# Altium schematic sheet Power System.SchDoc
size A; SheetNumber: 2; SheetTotal: 3
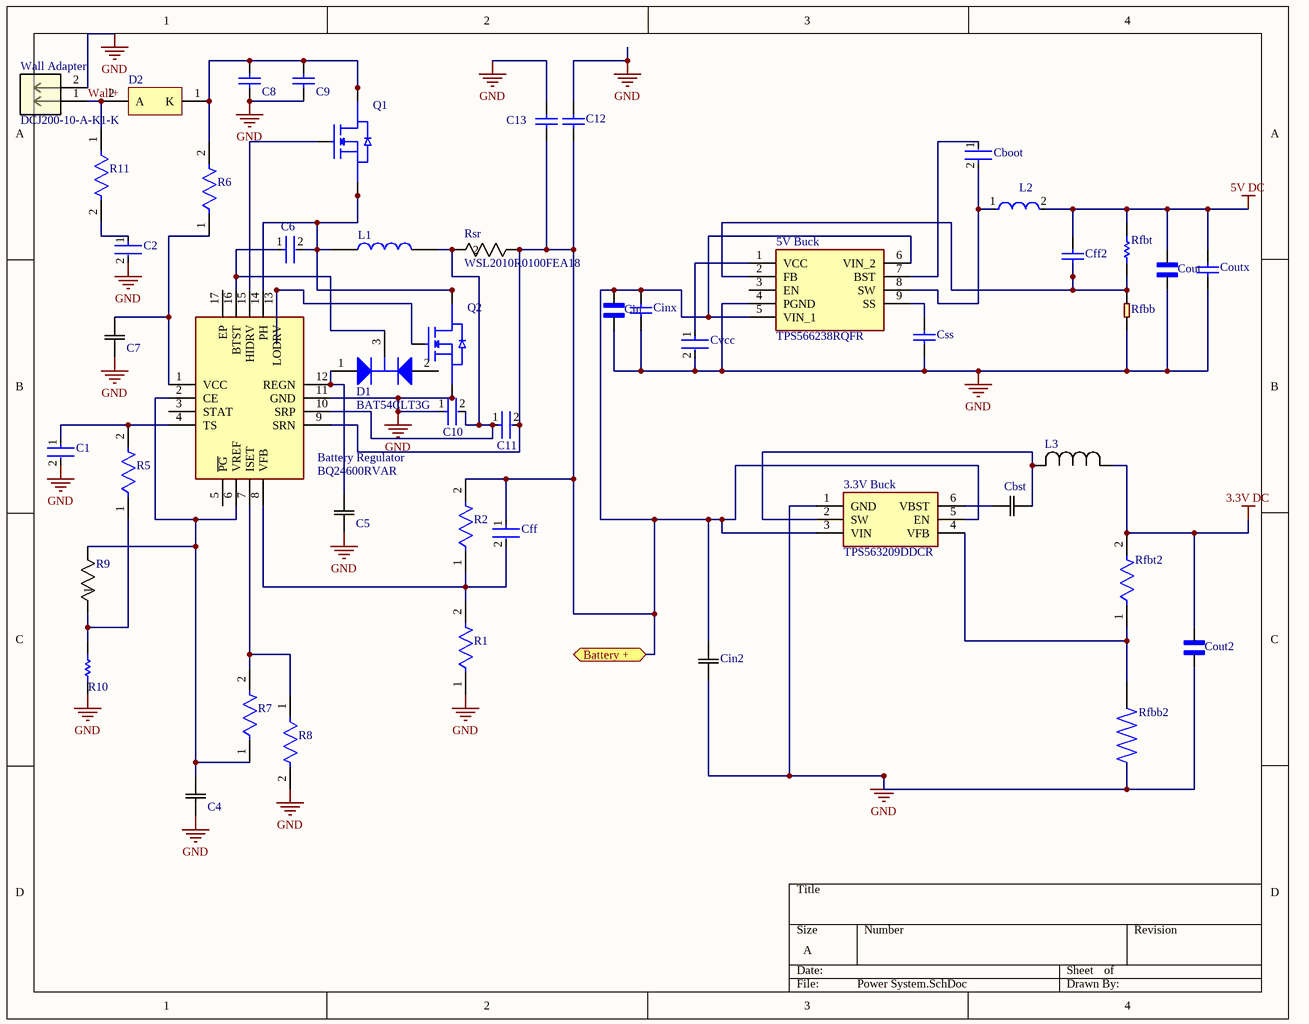
[diagram p0: Power System.SchDoc]

## Parts
3.3V_Buck  TPS563209DDCR  [SOT95P280X110-6N]
5V_Buck  TPS566238RQFR  [TPS566238RQFR]
Battery_Regulator  BQ24600RVAR  [QFN50P350X350X100-17N-D]
C1  C0603C104K4RAC7411  [FP-C0603C-CF-MFG]  (value not drawn)
C2  CGA5L3X7R1H225K160AB  [FP-CGA5L-0_3-0_1-IPC_C]  (value not drawn)
C4  C1206C105K4RACTU  [CAPC340180_140N_KEM]  (value not drawn)
C5  C1206C105K4RACTU  [CAPC340180_140N_KEM]  (value not drawn)
C6  C0603C104K4RAC7411  [FP-C0603C-CF-MFG]  (value not drawn)
C7  GRM32ER71H105KA01L  [CAP_GRM32ED_MUR]  (value not drawn)
C8  GRM32ER7YA106KA12L  [CAPC3225X270X30LL30]  (value not drawn)
C9  GRM32ER7YA106KA12L  [CAPC3225X270X30LL30]  (value not drawn)
C10  C0603C104K5RACTU  [FP-C0603C-CF-MFG]  (value not drawn)
C11  C0603C104K4RAC7411  [FP-C0603C-CF-MFG]  (value not drawn)
C12  GRM32ER7YA106KA12L  [CAPC3225X270X30LL30]  (value not drawn)
C13  GRM32ER7YA106KA12L  [CAPC3225X270X30LL30]  (value not drawn)
Cboot  GRM155R71C104KA88D  [FP-GRM15-MFG]  (value not drawn)
Cbst  08053C104KAT2A  [CAP_X7R_0805_AVX]  (value not drawn)
Cff  DE11XRB220KN4AR01F  [FP-DE1_D6_T5_F10_d0_6-0_0-MFG]  (value not drawn)
Cff2  06033A330JAT2A  [CAPC1608X90X35LL15T15]  (value not drawn)
Cin  MSASE21GBB5226MTNA01  [CAPC2012X145N]  (value not drawn)
Cin2  MSAST219LB5106KTNA01  [CAP_MSAS21-9_TAY]  (value not drawn)
Cinx  GRM188R71H104KA93D  [CAPC1608X90X35ML10T15]  (value not drawn)
Cout  LMK212BJ226MG-T  [CAPC2012X135N]  (value not drawn)
Cout2  GRM188R60J226MEA0D  [CAPC1608X100N]  (value not drawn)
Coutx  GRM188R71E104KA01D  [CAPC1608X90X35LL10T15]  (value not drawn)
Css  GRM155R71C103KA01D  [CAPC1005X55X25LL05T10]  (value not drawn)
Cvcc  EMK107B7105KA-T  [FP-0603-L_1_6_0_1-W_0_8_0-IPC_C]  (value not drawn)
D1  BAT54CLT3G  [ONSC-SOT-23-3-318-08_V]
D2  MBRS540T3G  [ONSC-SMC-2-403-03_V]  (value not drawn)
L1  IHLP2525CZER3R3MA1  [INDPM6965X300N]  (value not drawn)
L2  XAL5030-222MEB  [FP-XAL5030-222MEB-MFG]  (value not drawn)
L3  SRN8040-2R2Y  [IND_BOURNS_SRN8040]  (value not drawn)
Q1  SIR426DP-T1-GE3  [TRANS_SIRA90DP-T1-GE3]  (value not drawn)
Q2  SIR426DP-T1-GE3  [TRANS_SIRA90DP-T1-GE3]  (value not drawn)
R1  RR0816P-104-D  [FP-RR0816-IPC_A]  (value not drawn)
R2  RR0816P-304-D  [FP-RR0816-IPC_C]  (value not drawn)
R5  RR0816P-101-D  [FP-RR0816-MFG]  (value not drawn)
R6  RMCF2512JT10R0  [FP-RMCF2512-IPC_B]  (value not drawn)
R7  RR0816P-104-D  [FP-RR0816-IPC_A]  (value not drawn)
R8  RR0816P-154-D  [FP-RR0816-IPC_C]  (value not drawn)
R9  RMCF0402FT9K31  [RES_RMCF0402_STP]  (value not drawn)
R10  RC0402FR-07442KL  [RESC1005X40X25LL05T10]  (value not drawn)
R11  RMCF2512JT2R00  [FP-RMCF2512-IPC_A]  (value not drawn)
Rfbb  SMD-RES-30K-1%-1/10W(0603)  [R0603]  (value not drawn)
Rfbb2  M55342K11B10E0RS3  [RESC0905X41N]  (value not drawn)
Rfbt  RC0603FR-07220KL  [RESC1608X55X25ML10T15]  (value not drawn)
Rfbt2  CRCW040233K2FKED  [Vishay_CRCW0402-e3_MFG]  (value not drawn)
Rsr  WSL2010R0100FEA18  [RC2010N_VIS]
Wall_Adapter  DCJ200-10-A-K1-K  [CONN3_DCJ200-10-A-K1-K_GCT]

## Ports
Battery + (bidir)

## Nets
3.3V DC: Cout2.2 L3.1 Rfbt2.2
5V DC: Cff2.2 Cout.2 Coutx.2 L2.2 Rfbt.2
GND: 3.3V_Buck.1(GND) 5V_Buck.4(PGND) Battery_Regulator.11(GND) C1.2 C2.2 C4.1 C5.1 C7.1 C8.1 C9.1 C10.1 C12.2 C13.2 Cin.1 Cin2.1 Cinx.1 Cout.1 Cout2.1 Coutx.1 Css.1 Cvcc.2 Q2.1(S) Q2.2(S) Q2.3(S) R1.1 R8.2 R10.1 Rfbb.1 Rfbb2.1 Wall_Adapter.2
Battery +: 3.3V_Buck.3(VIN) 3.3V_Buck.5(EN) 5V_Buck.5(VIN_1) 5V_Buck.6(VIN_2) Battery_Regulator.9(SRN) C11.2 C12.1 C13.1 Cff.1 Cin.2 Cin2.2 Cinx.2 R2.2 Rsr.1 ; port Battery +
Wall+: D2.2(A) R11.1 Wall_Adapter.1
Net3.3V_Buck_2: 3.3V_Buck.2(SW) Cbst.2 L3.2
Net3.3V_Buck_4: 3.3V_Buck.4(VFB) Rfbb2.2 Rfbt2.1
Net3.3V_Buck_6: 3.3V_Buck.6(VBST) Cbst.1
Net5V_Buck_1: 5V_Buck.1(VCC) Cvcc.1
Net5V_Buck_2: 5V_Buck.2(FB) Cff2.1 Rfbb.2 Rfbt.1
Net5V_Buck_7: 5V_Buck.7(BST) Cboot.1
Net5V_Buck_8: 5V_Buck.8(SW) Cboot.2 L2.1
Net5V_Buck_9: 5V_Buck.9(SS) Css.2
NetBattery_Regulator_1: Battery_Regulator.1(VCC) C7.2 R6.1
NetBattery_Regulator_2: Battery_Regulator.2(CE) Battery_Regulator.6(VREF) C4.2 R7.1 R9.2
NetBattery_Regulator_4: Battery_Regulator.4(TS) C1.1 R5.2
NetBattery_Regulator_7: Battery_Regulator.7(ISET) R7.2 R8.1
NetBattery_Regulator_8: Battery_Regulator.8(VFB) Cff.2 R1.2 R2.1
NetBattery_Regulator_10: Battery_Regulator.10(SRP) C10.2 C11.1 L1.2 Rsr.2
NetBattery_Regulator_12: Battery_Regulator.12(REGN) C5.2 D1.1(A1)
NetBattery_Regulator_13: Battery_Regulator.13(LODRV) Q2.4(G)
NetBattery_Regulator_14: Battery_Regulator.14(PH) C6.2 L1.1 Q1.1(S) Q1.2(S) Q1.3(S) Q2.5(D) Q2.6(D) Q2.7(D) Q2.8(D) Q2.9(D)
NetBattery_Regulator_15: Battery_Regulator.15(HIDRV) Q1.4(G)
NetBattery_Regulator_16: Battery_Regulator.16(BTST) C6.1 D1.3(K)
NetC2_1: C2.1 R11.2
NetC8_2: C8.2 C9.2 D2.1(K) Q1.5(D) Q1.6(D) Q1.7(D) Q1.8(D) Q1.9(D) R6.2
NetR5_1: R5.1 R9.1 R10.2

Not connected (* = marked no-connect by the designer): 5V_Buck 3(EN); Battery_Regulator 3(STAT) 5(~{PG}) 17(EP); D1 2(A2)

## Library data of the parts
3.3V_Buck = CMP-006-000000-1: 17 V Input, 3A Synchronous Step-Down Regulator in SOT-23; Manufacturer_Name: Texas Instruments; Geometry.Height: 1.1mm; Datasheet Link: http://www.ti.com/lit/gpn/tps563209; Mouser Part Number: 595-TPS563209DDCR; Mouser Price/Stock: https://www.mouser.co.uk/ProductDetail/Texas-Instruments/TPS563209DDCR?qs=bT6MOr62zwIer%2FLlyIAhvQ%3D%3D; Source: TPS563209DDCR.SchLib; Manufacturer_Part_Number: TPS563209DDCR; Design Item ID: TPS563209DDCR
5V_Buck = CMP-009-000000-1: Switching Voltage Regulators 3-V to 18-V input, 6-A synchronous step-down regulator with forced continuous conduction mode 9-VQFN-HR -40 to 125; Manufacturer_Name: Texas Instruments; Geometry.Height: 1mm; Manufacturer_Part_Number: TPS566238RQFR; Mouser Price/Stock: https://www.mouser.co.uk/ProductDetail/Texas-Instruments/TPS566238RQFR?qs=stqOd1AaK7%252BIxOvIy4vX6A%3D%3D; Mouser Part Number: 595-TPS566238RQFR; Datasheet Link: https://www.ti.com/lit/ds/symlink/tps566238.pdf?ts=1674445033157&ref_url=https%253A%252F%252Fwww.ti.com%252Fproduct%252FTPS566238%252Fpart-details%252FTPS566238RQFR; Design Item ID: TPS566238RQFR; Source: TPS566238RQFR.SchLib
Battery_Regulator = CMP-012-000000-1: Synchronous Switch-Mode Li-Ion or Li-Polymer Battery Charger; Manufacturer_Name: Texas Instruments; Geometry.Height: 1mm; Design Item ID: BQ24600RVAR; Mouser Part Number: 595-BQ24600RVAR; Mouser Price/Stock: https://www.mouser.co.uk/ProductDetail/Texas-Instruments/BQ24600RVAR?qs=3cDLNOBdYaUoGcV3mObKiw%3D%3D; Datasheet Link: http://www.ti.com/lit/gpn/bq24600; Source: BQ24600RVAR.SchLib; Manufacturer_Part_Number: BQ24600RVAR
C1 C6 C11 = CMP-2006-03724-3: CAP CER 0.1UF 16V X7R 0603; Manufacturer: KEMET; Value: 0.10 μF; Tolerance: 0.1; Temperature Coefficient: 30ppm/°C; Material: Ceramic; Automotive Grade: Grade 1; Temperature Range High: +125°C; Category: Cap; Temperature: -55°C to +125°C; RoHS: TRUE; Temperature Characteristic: X7R; Height: 0.87mm; Lead Free: Yes; Automotive: Yes; Digikey Description: CAP CER 0.1UF 16V X7R 0603; Device Class L2: Capacitors; Mouser Description: Cap Ceramic 0.1uF 16V X7R 10% SMD 0603 125°C Paper T/R; Capacitance: 0.10 μF; Device Class L1: Passive Components; Temperature Range Low: -55°C; ComponentLink2Description: Datasheet; ComponentLink2URL: https://api.kemet.com/component-edge/download/datasheet/C0603C100J5GACAUTO.pdf; Voltage Rating: 16 V; Octopart: https://octopart.com/c0603c104k4rac7411-kemet-3919501; Device Class L3: Ceramic Capacitors; Manufacturer Part Number: C0603C104K4RAC7411; Package: C0603C-CF
C2 = CMP-08246-002495-1: Cap Ceramic 2.2uF 50V X7R 10% Pad SMD 1206 +125°C Automotive T/R; Package Quantity: 1; Case Code (Metric): 3216; Voltage Rating: 50V; Depth: 1.6mm; Min Operating Temperature: -55°C; Tolerance: 10%; Mount: Surface Mount; Termination: SMD/SMT; Ratings: AEC-Q200; Height: 1.6mm; Case/Package: 1206; Max Operating Temperature: 125°C; Capacitance: 2.2uF; REACH SVHC: No SVHC; Thickness: 0.075inch; Weight: 0.000571oz; Voltage Rating (DC): 50V; Length: 3.2mm; Case Code (Imperial): 1206; Width: 0.063inch; Packaging: Tape and Reel; Composition: Ceramic; Dielectric: X7R
C4 C5 = C1206C105K4RACTU: SMD Comm X7R, Ceramic, 1 uF, 10%, 16 VDC, X7R, SMD, MLCC, Temperature Stable, Class II, 1206; Manufacturer_Name: Kemet; Copyright: Copyright (C) 2025 Ultra Librarian. All rights reserved.; Manufacturer_Part_Number: C1206C105K4RACTU; Datasheet: https://content.kemet.com/datasheets/KEM_C1002_X7R_SMD.pdf
C7 = GRM32ER71H105KA01L: No Description Available; Manufacturer_Name: Murata; Copyright: Copyright (C) 2025 Ultra Librarian. All rights reserved.; Manufacturer_Part_Number: GRM32ER71H105KA01L
C8 C9 C12 C13 = CMP-1038-02234-2: Chip Capacitor, 10 uF, +/- 10%, 35 V, -55 to 125 degC, 1210 (3225 Metric), RoHS, Tape and Reel; Manufacturer: Murata; Capacitance: 10µF; Rated voltage: 35VDC; Ceramic type: X7R; Construction form: 1210; Package Description: 2-Pin Surface Mount Device, Body 3.2 x 2.5 mm; Datasheet Version: 11/2014; Capacitance tolerance: ±10%; Datasheet URL: https://datasheet.ciiva.com/3777/grm32er7ya106ka1223-3777248.pdf; Package Reference: 1210; Manufacturer URL: http://www.murata.com/; Mounting Technology: SurfaceMount
C10 = CMP-2006-03061-2: CAP CER 0.1UF 50V X7R 0603; Manufacturer: KEMET; Tolerance: 0.1; Temperature Coefficient: 30ppm/°C; Material: Ceramic; Automotive Grade: Grade 1; Value: 0.10 μF; Temperature: -55°C to +125°C; RoHS: TRUE; Temperature Range High: +125°C; Lead Free: Yes; Octopart: https://octopart.com/c0603c104k5ractu-kemet-139244; Digikey Description: CAP CER 0.1UF 50V X7R 0603; Category: Cap; Package: C0603C-CF; ComponentLink2Description: Datasheet; Temperature Range Low: -55°C; Device Class L1: Passive Components; Voltage Rating: 50 V; Automotive: Yes; Device Class L3: Ceramic Capacitors; ComponentLink2URL: https://api.kemet.com/component-edge/download/datasheet/C0603C100J5GACAUTO.pdf; Capacitance: 0.10 μF; Device Class L2: Capacitors; Manufacturer Part Number: C0603C104K5RACTU; Temperature Characteristic: X7R; Height: 0.87mm
Cboot = CMP-2100-03641-2: CAP CER 0.1UF 16V X7R 0402; Manufacturer: Murata; Standoff Height: 0mm; Tolerance: 10%; Voltage Rating: 16Vdc; Capacitance: 0.10μF; Value: 0.10μF; RoHS: TRUE; Manufacturer Part Number: GRM155R71C104KA88D; Temperature Characteristic: X7R; Octopart: https://octopart.com/grm155r71c104ka88d-murata-196880; Digikey Description: CAP CER 0.1UF 16V X7R 0402; Device Class L3: Ceramic Capacitors; Height: 0.55mm; ComponentLink2Description: Datasheet; Temperature Range Low: -55°C; Ipc Land Pattern Name: CAPC10050X219; ComponentLink2URL: https://search.murata.co.jp/Ceramy/image/img/A01X/G101/ENG/GRM155R71H471KA01-01A.pdf; Device Class L1: Passive Components; Lead Free: yes; Category: Cap; Package: GRM15; Temperature: -55°C to +125°C; Device Class L2: Capacitors; Material: Ceramic; Temperature Range High: +125°C; Mouser Description: 0402 0.1 uF 16V ±10 % Tolerance X7R SMT Multilayer Ceramic Capacitor
Cbst = 08053C104KAT2A: Description; Manufacturer_Name: KYOCERA AVX; Copyright: Copyright (C) 2025 Ultra Librarian. All rights reserved.; Manufacturer_Part_Number: 08053C104KAT2A
Cff = CMP-06035-012369-1: Cap Ceramic Disc 22pF 10% 500VAC Thru-Hole 6.0x5.0x10.0 Ammo pack
Cff2 = CMP-2006-04137-1: Manufacturer: AVX Interconnect / Elco; Part Number: 06033A330JAT2A
Cin = MSASE21GBB5226MTNA01: MF: {'manufacturer': u'Taiyo Yuden'}; Package: None; Price: None; Value: *; MP: MSASE21GBB5226MTNA01; Availability: Unavailable
Cin2 = MSAST219LB5106KTNA01: Description; Manufacturer_Name: TAIYO YUDEN; Copyright: Copyright (C) 2025 Ultra Librarian. All rights reserved.; Manufacturer_Part_Number: MSAST219LB5106KTNA01
Cinx = CMP-2100-03643-1: Chip Capacitor, 0.1 uF, +/- 10%, 50 V, -55 to 125 degC, 0603 (1608 Metric), RoHS, Tape and Reel; Manufacturer: Murata; Dielectric Material: Ceramic; Voltage Rating: 50V; Capacitance: 100nF; Dielectric: X7R; Insulation Resistance: 10GR; Case Code (Metric): 1608; Lead Free: LeadFree; Depth: 0.8mm; Number of Pins: 2; Radiation Hardening: No; Case/Package: 0603; Manufacturer URL: http://www.murata.com/; Packaging: TapeandReel; Length: 1.6mm; Contact Plating: Tin; Datasheet URL: http://psearch.en.murata.com/capacitor/product/GRM188R71H104KA93%23.pdf; Tolerance: 10%; Case Code (Imperial): 0603; Min Operating Temperature: -55degC; RoHSCompliant: true; Voltage: 50V; Termination: SMD/SMT; Mount: SurfaceMount; Material: Ceramic; Package Quantity: 1; Height: 0.8mm; Thickness: 0.035inch; REACH SVHC: NoSVHC; Max Operating Temperature: 125degC; Width: 0.8mm; Package Reference: 0603; Voltage Rating (DC): 50V; Datasheet Version: 42675.0; Package Description: 2-Pin Surface Mount Device, Body 1.6 x 0.8 mm
Cout = LMK212BJ226MG-T: MP: altium_native_batch; Package: None; Price: None; Value: *; Availability: Unavailable
Cout2 = GRM188R60J226MEA0D: 22 ÂµF Â±20% 6.3V Ceramic Capacitor X5R 0603 (1608 Metric); MF: Murata; SnapEDA_Link: https://www.snapeda.com/parts/GRM188R60J226MEA0D/Murata/view-part/?ref=snap; Package: 1608 Murata; Value: *; MP: GRM188R60J226MEA0D; Check_prices: https://www.snapeda.com/parts/GRM188R60J226MEA0D/Murata/view-part/?ref=eda
Coutx = CMP-2006-02868-1: Manufacturer: Murata; Part Number: GRM188R71E104KA01D
Css = CMP-2000-06332-1: Chip Capacitor, 10 nF, 16 V, 10%, -55 to 125 degC, 0402 (1005 Metric), RoHS, Tape and Reel; Manufacturer: Murata; Rated Voltage: 16V; Capacitance: 10000pF; Dielectric: X7R; Manufacturer URL: http://www.murata.com/; Package Description: 2-Pin Surface Mount Device, Body 1 x 0.5 mm; Case Size/Dimension: 0402; Tolerance (%): ±10%; Datasheet Version: 06/2016; Package Reference: 0402; Mounting Technology: SurfaceMount; Datasheet URL: http://psearch.en.murata.com/capacitor/product/GRM155R71C103KA01%23.pdf
Cvcc = CMP-14477-000018-3: None; Voltage Rating (DC): 16V; Dielectric: X7R; Capacitance: 1uF; Tolerance: 10%; Halogen Free: Halogen Free; Height: 0.8mm; REACH SVHC: No SVHC; Contact Plating: Nickel; Number of Pins: 2; Resistor Type: Ceramic; Series: M; Thickness: 0.035inch; Construction: Flat; Voltage Rating: 16V; Packaging: Tape and Reel; Width: 0.031inch; Length: 1.6mm; Case Code (Metric): 1608; RoHS Compliant: Yes; Termination: SMD/SMT; Min Operating Temperature: -55°C; Case/Package: 0603; Mount: Surface Mount; Case Code (Imperial): 0603; Depth: 0.8mm; Package Quantity: 1; Max Operating Temperature: 125°C; Lead Free: Lead Free; Radiation Hardening: No
D1 = CMP-1055-00545-1: Dual Common Cathode Schottky Barrier Diodes, 3-Pin SOT-23, Pb-Free, Tape and Reel; Manufacturer: On Semiconductor; IFSM Max (A): 0.6; trr Max (ns): 5; ComponentLink3Description: Package Specification; PackageDescription: 3-Pin Small Outline Transistor, Body 2.92 x 1.3 mm, Pitch 0.95 mm; PartNumber: BAT54CLT3G; Packing: Tape and Reel; ComponentLink1URL: http://www.onsemi.com/; ComponentLink2URL: http://www.onsemi.cn/pub_link/Collateral/BAT54CLT1-D.PDF; RoHS: TRUE; PackageReference: SOT-23-3-318-08; DatasheetVersion: Rev. 8; PackageVersion: Rev. AP, 11/2009; ComponentLink3URL: http://www.onsemi.cn/pub_link/Collateral/318-08.PDF; Configuration: Common Cathode; ComponentLink2Description: Datasheet; Mounting Technology: Surface Mount; ComponentLink1Description: Manufacturer URL
D2 = CMP-1055-00390-1: Schottky Power Rectifier, 2-Pin SMC, Pb-Free, Tape and Reel; Manufacturer: On Semiconductor; Configuration: Single; IFSM Max (A): 190; ComponentLink1URL: http://www.onsemi.com/; ComponentLink3URL: http://www.onsemi.com/pub_link/Collateral/403-03.PDF; ComponentLink1Description: Manufacturer URL; PackageVersion: Rev. E, 08/2005; Packing: Tape and Reel; ComponentLink2URL: http://www.onsemi.cn/pub_link/Collateral/MBRS540T3-D.PDF; RoHS: TRUE; DatasheetVersion: Rev. 8; Mounting Technology: Surface Mount; ComponentLink3Description: Package Specification; ComponentLink2Description: Datasheet; PartNumber: MBRS540T3G; PackageDescription: 2-Pin Small Molded Package, J-Bend Lead, Body 5.845 x 6.855 mm; PackageReference: SMC-2-403-03
L1 = IHLP2525CZER3R3MA1: Power Choke Shielded Wirewound 3.3uH 20% 100KHz Powdered Iron 6A 0.03Ohm DCR 2525 Automotive T/R; Manufacturer_Name: Vishay; Geometry.Height: 3mm; Mouser Part Number: 70-IHLP2525CZR3R3MA1; Mouser Price/Stock: https://www.mouser.co.uk/ProductDetail/Vishay-Dale/IHLP2525CZER3R3MA1?qs=ROh%252BA47s9d1%252BbNZuCM0reg%3D%3D; Manufacturer_Part_Number: IHLP2525CZER3R3MA1; Datasheet Link: https://www.vishay.com/docs/34241/ihlp-2525cz-a1.pdf
L2 = CMP-11268-000050-1: Fixed Inductors 2.2uH 20% 9.7A 14.5mOhms; DC Resistance (DCR): 14.5mR; Shielding: Shielded; Max DC Current: 9.2A; Test Frequency: 100kHz; Self Resonant Frequency: 38MHz; Core Material: Composite; Lead Free: Contains Lead; Inductance: 2.2uH; Max Operating Temperature: 125°C; Termination: SMD/SMT; Min Operating Temperature: -40°C; Height: 3.1mm; Package Quantity: 20; Packaging: Tape and Reel; Tolerance: 20%; Length: 5.68mm; Width: 5.48mm
L3 = SRN8040-2R2Y: Description; Manufacturer_Name: Bourns Electronics; Copyright: Copyright (C) 2025 Ultra Librarian. All rights reserved.; Manufacturer_Part_Number: SRN8040-2R2Y
Q1 Q2 = SIR426DP-T1-GE3: 40V 30A 41.7W 10.5mohm @ 10V | Siliconix / Vishay SIR426DP-T1-GE3; MF: Vishay Siliconix; SnapEDA_Link: https://www.snapeda.com/parts/SIR426DP-T1-GE3/Vishay/view-part/?ref=snap; Package: PowerPAK SO-8 Vishay; Value: *; MP: SIR426DP-T1-GE3; Check_prices: https://www.snapeda.com/parts/SIR426DP-T1-GE3/Vishay/view-part/?ref=eda
R1 R7 = CMP-2000-02426-2: 100kΩ ±0.5% 0.0625W 1/16W Chip Resistor 0603 (1608 Metric) Thin Film; Resistance: 100kR; Max Power Dissipation: 63mW; Working Voltage: 75V; Temperature Coefficient: 25ppm/°C; Technology: THIN FILM; Width: 0.8mm; Length: 1.6mm; Number of Pins: 2; Case Code (Metric): 1608; Tolerance: 0.5%; Case Code (Imperial): 0603; Resistor Type: Thin Film; Voltage Rating (DC): 75V; Lead Free: Lead Free; Max Operating Temperature: 125°C; Series: RR; Voltage Rating: 75V; Termination: SMD/SMT; Depth: 0.8mm; Power Rating: 63mW; Min Operating Temperature: -55°C; Packaging: Tape and Reel; Height: 0.4mm; Package Quantity: 1; RoHS Compliant: Yes; Number of Terminations: 2; Resistance Tolerance: 0.5%; Case/Package: 0603
R2 = CMP-2000-02605-2: 300kΩ ±0.5% 0.0625W 1/16W Chip Resistor 0603 (1608 Metric) Thin Film; Voltage Rating (DC): 75V; Resistance: 300kR; Temperature Coefficient: 25ppm/°C; Max Power Dissipation: 63mW; Series: RR; Termination: SMD/SMT; Case Code (Metric): 1608; Max Operating Temperature: 125°C; Lead Free: Lead Free; Technology: THIN FILM; Number of Pins: 2; Tolerance: 0.5%; Packaging: Tape and Reel; Length: 0.063inch; RoHS Compliant: Yes; Width: 0.031inch; Min Operating Temperature: -55°C; Height: 0.02inch; Package Quantity: 1; Case Code (Imperial): 0603; Number of Terminations: 2; Voltage Rating: 75V; Size Code: 0603; Resistance Tolerance: 0.5%; Power Rating: 63mW; Depth: 0.8mm; Resistor Type: Thin Film; Case/Package: 0603
R5 = CMP-2000-02416-2: 100Ω ±0.5% 0.0625W 1/16W Chip Resistor 0603 (1608 Metric) Thin Film; Voltage Rating: 75V; Power Rating: 63mW; Resistance: 100R; Temperature Coefficient: 25ppm/°C; Number of Terminations: 2; Resistance Tolerance: 0.5%; Termination: SMD/SMT; Tolerance: 0.5%; Case/Package: 0603; Series: RR; Min Operating Temperature: -55°C; Case Code (Imperial): 0603; Number of Pins: 2; Packaging: Cut Tape; Width: 0.031inch; Resistor Type: Thin Film; RoHS Compliant: Yes; Lead Free: Lead Free; Depth: 0.8mm; Technology: THIN FILM; Size Code: 0603; Voltage Rating (DC): 75V; Package Quantity: 1; Case Code (Metric): 1608; Length: 1.6mm; Height: 0.4mm; Max Operating Temperature: 125°C; Weight: 7.1E-05oz; Max Power Dissipation: 63mW
R6 = CMP-26527-002316-1: 10Ω ±5% 1W 2512 Thick Film Chip Resistor AEC-Q200 compliant; Temperature Coefficient: 200ppm/°C; Resistance: 10R; Height: 0.028inch; RoHS Compliant: Yes; Military Standard: Not; Packaging: Tape and Reel; Depth: 3.2mm; Number of Terminations: 2; Width: 0.126inch; Case Code (Imperial): 2512; Lead Free: Lead Free; Size Code: 2512; Mount: Surface Mount; Max Power Dissipation: 1W; Case/Package: 2512; Contact Plating: Tin; Radiation Hardening: No; Case Code (Metric): 6432; Length: 0.248inch; Series: RMCF; Construction: Rectangular; Features: Automotive AEC-Q200; Power Rating: 1W; Max Operating Temperature: 155°C; Resistor Type: Thick Film; Tolerance: 5%; Min Operating Temperature: -55°C
R8 = CMP-2000-02489-2: 150kΩ ±0.5% 0.0625W 1/16W Chip Resistor 0603 (1608 Metric) Thin Film; Power Rating: 63mW; Voltage Rating: 75V; Resistance: 150kR; Temperature Coefficient: 25ppm/°C; Case Code (Imperial): 0603; Resistance Tolerance: 0.5%; Termination: SMD/SMT; Max Operating Temperature: 125°C; Package Quantity: 1; Case/Package: 0603; Technology: THIN FILM; Number of Pins: 2; Height: 0.4mm; Depth: 0.8mm; Resistor Type: Thin Film; RoHS Compliant: Yes; Max Power Dissipation: 63mW; Tolerance: 0.5%; Voltage Rating (DC): 75V; Number of Terminations: 2; Case Code (Metric): 1608; Width: 0.8mm; Lead Free: Lead Free; Packaging: Tape and Reel; Series: RR; Size Code: 0603; Length: 1.6mm; Min Operating Temperature: -55°C
R9 = RMCF0402FT9K31: No Description Available; Manufacturer_Name: Stackpole International; Copyright: Copyright (C) 2025 Ultra Librarian. All rights reserved.; Manufacturer_Part_Number: RMCF0402FT9K31
R10 = CMP-2002-07689-1: Manufacturer: Yageo / Phycomp; Part Number: RC0402FR-07442KL
R11 = CMP-26527-006700-1: 2Ω ±5% 1W 2512 Thick Film Chip Resistor AEC-Q200 compliant; Temperature Coefficient: 400ppm/°C; Resistance: 2R; Resistor Type: Thick Film; Max Power Dissipation: 1W; Lead Free: Lead Free; Length: 0.248inch; Size Code: 2512; Min Operating Temperature: -55°C; Mount: Surface Mount; Width: 0.126inch; Features: Automotive AEC-Q200; Depth: 3.2mm; Max Operating Temperature: 155°C; Height: 0.028inch; Number of Terminations: 2; Military Standard: Not; Case Code (Imperial): 2512; Case Code (Metric): 6432; Contact Plating: Tin; Power Rating: 1W; Series: RMCF; Construction: Rectangular; Tolerance: 5%; Case/Package: 2512; RoHS Compliant: Yes; Packaging: Tape and Reel; Radiation Hardening: No
Rfbb = SMD-RES-30K-1%-1/10W(0603): 30 kOhms Â±1% 0.1W, 1/10W Chip Resistor 0603 (1608 Metric) Moisture Resistant Thick Film; MF: Yageo; MP: RC0603FR-0730KL; Package: SMD-2 Yageo; Price: None; Check_prices: https://www.snapeda.com/parts/RC0603FR-0730KL/Yageo/view-part/?ref=eda; Value: *; SnapEDA_Link: https://www.snapeda.com/parts/RC0603FR-0730KL/Yageo/view-part/?ref=snap; Availability: In Stock; Purchase-URL: https://pricing.snapeda.com/search?q=RC0603FR-0730KL&ref=eda
Rfbt = CMP-1659-00037-1: Chip Resistor, 220 KOhm, +/- 1%, 100 mW, -55 to 155 degC, 0603 (1608 Metric), RoHS, Tape and Reel; Resistance: 0.1 Ohm; ComponentLink1Description: Manufacturer URL; ComponentLink2Description: Datasheet; ComponentLink1URL: http://www.yageo.com/; REACH SVHC: No SVHC; RoHSCompliant: true; DatasheetVersion: Rev. 4, 02/2016; Min Operating Temperature: -25 degC; Height: 0.25 inch; ComponentLink2URL: http://www.yageo.com/documents/recent/PYu-RC_Group_51_RoHS_L_04.pdf; PackageDescription: 2-Pin Surface Mount Device, Body 1.6 x 0.8 mm; Max Operating Temperature: 70 degC; Width: 0.25 inch; Length: 0.75 inch; PackageReference: 0603
Rfbt2 = CMP-2002-08529-2: NexarPartId: 39869749; Power Rating: 63mW; Temperature Coefficient: 100ppm/°C; Resistance: 33.2kΩ; Voltage Rating: 50V; Tolerance: 1%; REACH SVHC: Unknown; Number of Pins: 2; Military Standard: Not; Composition: Thick Film; Case Code (Imperial): 0402; Number of Terminations: 2; Lead Free: Lead Free; Case Code (Metric): 1005; Termination: SMD/SMT; Case/Package: 0402; Contact Plating: Tin; Height: 350µm; Min Operating Temperature: -55°C; Mount: Surface Mount; Max Operating Temperature: 155°C; Features: Automotive AEC-Q200; Length: 1mm; Weight: 652.039032µg; Packaging: Cut Tape; Schedule B: 8533210045, 8533210045; Voltage Rating (DC): 50V; Depth: 500µm; Max Power Dissipation: 63mW; RoHS: Compliant; Radiation Hardening: No; Width: 500µm
Rsr = WSL2010R0100FEA18: WSL-2010-18 .01 1% EA e3; Manufacturer_Name: Vishay; Copyright: Copyright (C) 2025 Ultra Librarian. All rights reserved.; Manufacturer_Part_Number: WSL2010R0100FEA18
Wall_Adapter = DCJ200-10-A-K1-K: Description; Manufacturer_Name: Global Connector Technology; Copyright: Copyright (C) 2025 Ultra Librarian. All rights reserved.; Manufacturer_Part_Number: DCJ200-10-A-K1-K; RefDes: RefDes; Type: Type
Rfbb2 = M55342K11B10E0RS3: Package: None; Price: None; Value: *; MP: M55342K11B10E0RS3; Availability: Unavailable